# Altium schematic sheet lpf_160.SchDoc: mcHF Pro Transceiver RF board
size A3; Author: Krassi Atanassov; CompanyName: MØNKA; Engineer: For radio amateurs experimentation, non-commercial use only. Thank you!; Revision: 0.8.2; SheetTotal: 14
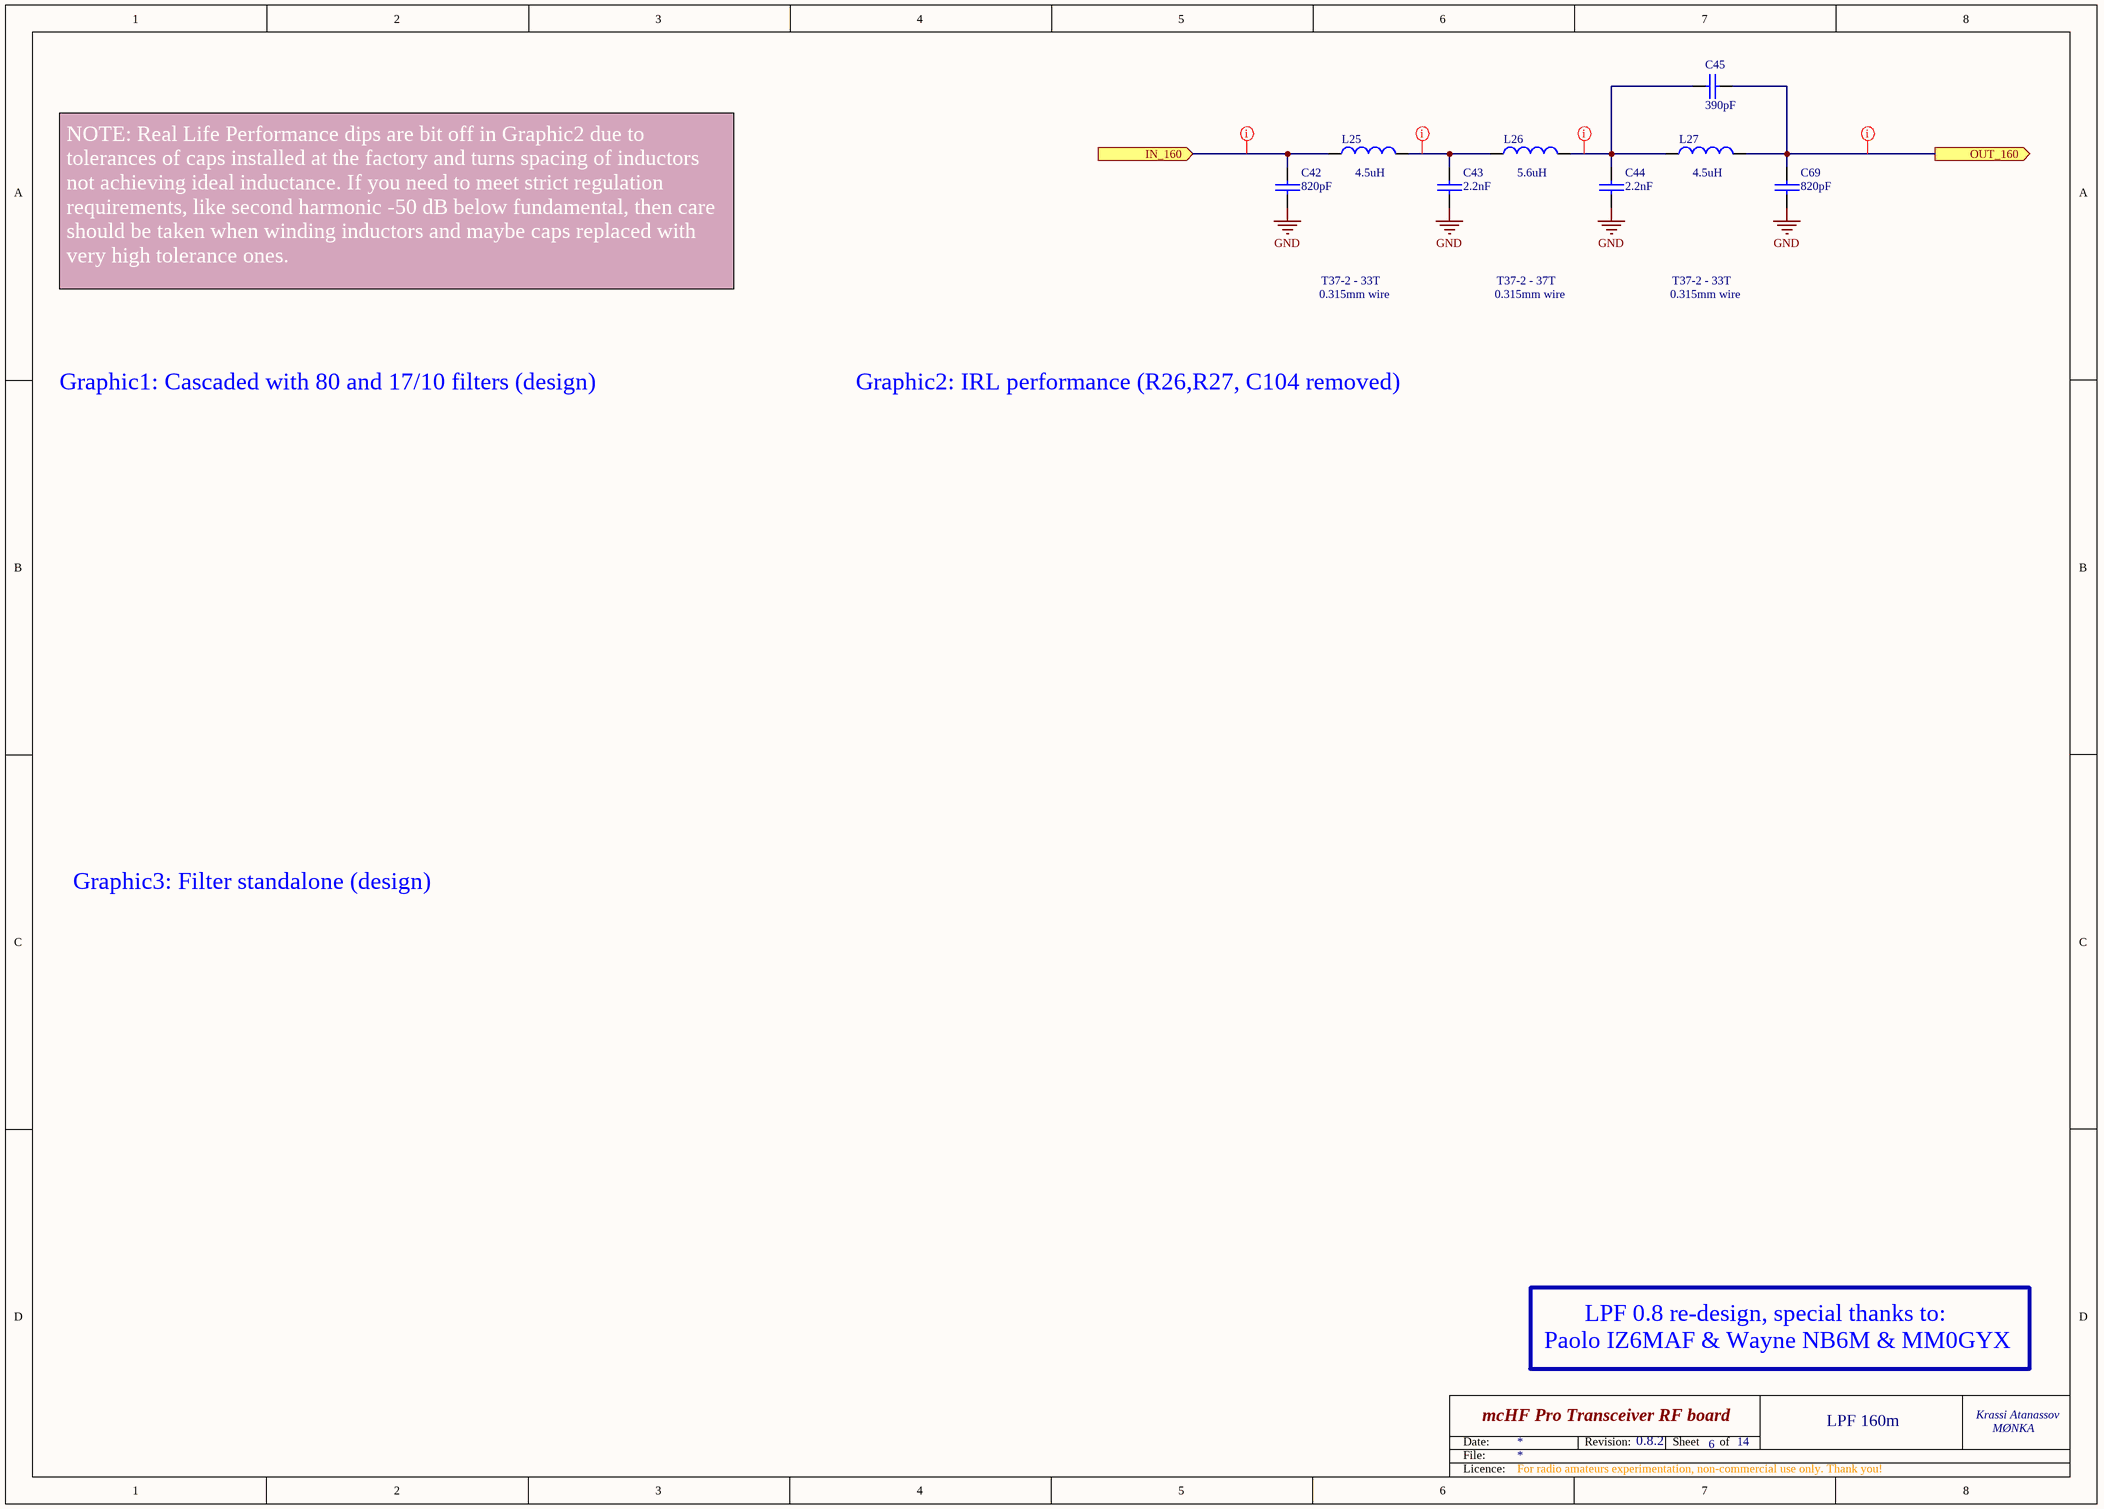
[diagram p0: lpf_160.SchDoc]

## Parts
C42  820pF  [0805]
C43  2.2nF  [0805]
C44  2.2nF  [0805]
C45  390pF  [0805]
C69  820pF  [0805]
L25  Inductance: 4.5uH  [LPF_IND]  (hidden comment: T37-2)
L26  Inductance: 5.6uH  [LPF_IND]  (hidden comment: T37-2)
L27  Inductance: 4.5uH  [LPF_IND]  (hidden comment: T37-2)

## Ports
IN_160 (in), OUT_160 (out)

## Nets
GND: C42.2 C43.2 C44.2 C69.2
IN_160: C42.1 L25.1 ; port IN_160
OUT_160: C45.1 C69.1 L27.2 ; port OUT_160
NetC43_1: C43.1 L25.2 L26.1
NetC44_1: C44.1 C45.2 L26.2 L27.1

## Layout directives
rule Width Constraint [Pref Width = 30mil    Min Width = 30mil    Max Width = 30mil]: IN_160, NetC43_1, NetC44_1, OUT_160

## Notes on the sheet
- NOTE: Real Life Performance dips are bit off in Graphic2 due to tolerances of caps installed at the factory and turns spacing of inductors not achieving ideal inductance. If you need to meet strict regulation requirements, like second harmonic -50 dB below fundamental, then care should be taken when winding inductors and maybe caps replaced with very high tolerance ones.
- T37-2 - 33T
- 0.315mm wire
- T37-2 - 37T
- Graphic1: Cascaded with 80 and 17/10 filters (design)
- Graphic2: IRL performance (R26,R27, C104 removed)
- Graphic3: Filter standalone (design)
- LPF 0.8 re-design, special thanks to:
- Paolo IZ6MAF & Wayne NB6M & MM0GYX
- 9
- LPF 160m
- Date:
- File:
- Revision:
- Sheet
- of
- Licence:

## Library data of the parts
C42-C44 C69 = CAP: Capacitor; Notes: COG/NPO; Voltage: 100V
C45 = CAP: Capacitor; QT Order: QCC-00125; Notes: COG/NPO; Voltage: 100V; Price: 0.078
L25-L27 = LPF_IND: T37-2 handwound inductor; Notes: post assembly; Price: 0.20